# Altium schematic sheet Power Supply.SchDoc
size A4; SheetNumber: 7; SheetTotal: 9
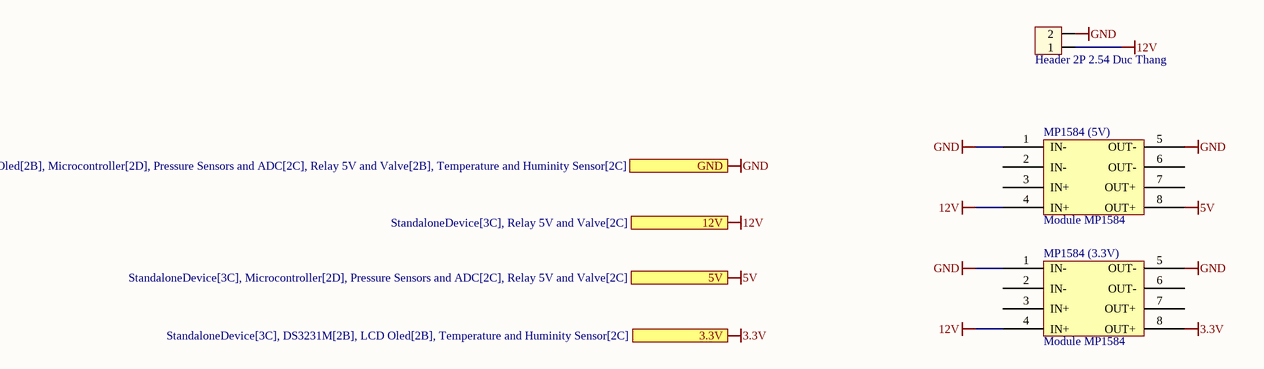
[diagram p0: Power Supply.SchDoc]

## Parts
MP1584_(3.3V)  Module MP1584  [module mP1584]
MP1584_(5V)  Module MP1584  [module mP1584]
POW  Header 2P 2.54 Duc Thang  [XH2.54M-2]

## Ports
3.3V (see StandaloneDevice[3C], DS3231M[2B], LCD Oled[2B], Temperature and Huminity Sensor[2C]), 5V (see StandaloneDevice[3C], Microcontroller[2D], Pressure Sensors and ADC[2C], Relay 5V and Valve[2C]), 12V (see StandaloneDevice[3C], Relay 5V and Valve[2C]), GND (see StandaloneDevice[3C], DS3231M[2B], LCD Oled[2B], Microcontroller[2D], Pressure Sensors and ADC[2C], Relay 5V and Valve[2B], Temperature and Huminity Sensor[2C])

## Nets
3.3V: MP1584_(3.3V).8(OUT+) ; port 3.3V
5V: MP1584_(5V).8(OUT+) ; port 5V
12V: MP1584_(3.3V).4(IN+) MP1584_(5V).4(IN+) POW.1 ; port 12V
GND: MP1584_(3.3V).1(IN-) MP1584_(3.3V).5(OUT-) MP1584_(5V).1(IN-) MP1584_(5V).5(OUT-) POW.2 ; port GND

Not connected (* = marked no-connect by the designer): MP1584_(3.3V) 2(IN-) 3(IN+) 6(OUT-) 7(OUT+); MP1584_(5V) 2(IN-) 3(IN+) 6(OUT-) 7(OUT+)

## Library data of the parts
MP1584_(3.3V) MP1584_(5V) = Module MP1584: MF: Espressif Systems; MP: ESP32 NODEMCU; SnapEDA_Link: https://www.snapeda.com/parts/ESP32%20NODEMCU/Espressif+Systems/view-part/?ref=snap; Package: Package; Value: *; Check_prices: https://www.snapeda.com/parts/ESP32%20NODEMCU/Espressif+Systems/view-part/?ref=eda
POW = Header 2P 2.54 Duc Thang: Cắm; Ten_Linh_Kien: Header 2P XH2.54-2P Đực Thẳng; Don_Vi: Con; Ma_Hang: MH001283; Chung_Loai: Cắm